# EasyEDA Pro project ProPrj_STM32音响_2025-06-08.epro, schematic TPA3116_替代方案
Board Name: TPA3116; Create Date: 2025-05-03; Page Name: TPA3116_TEST; Project Name: STM32多功能音响; Schematic Name: TPA3116_替代方案; Update Date: 2025-05-04; Company: 嘉立创EDA; Page Size: A4; Version: V1.0
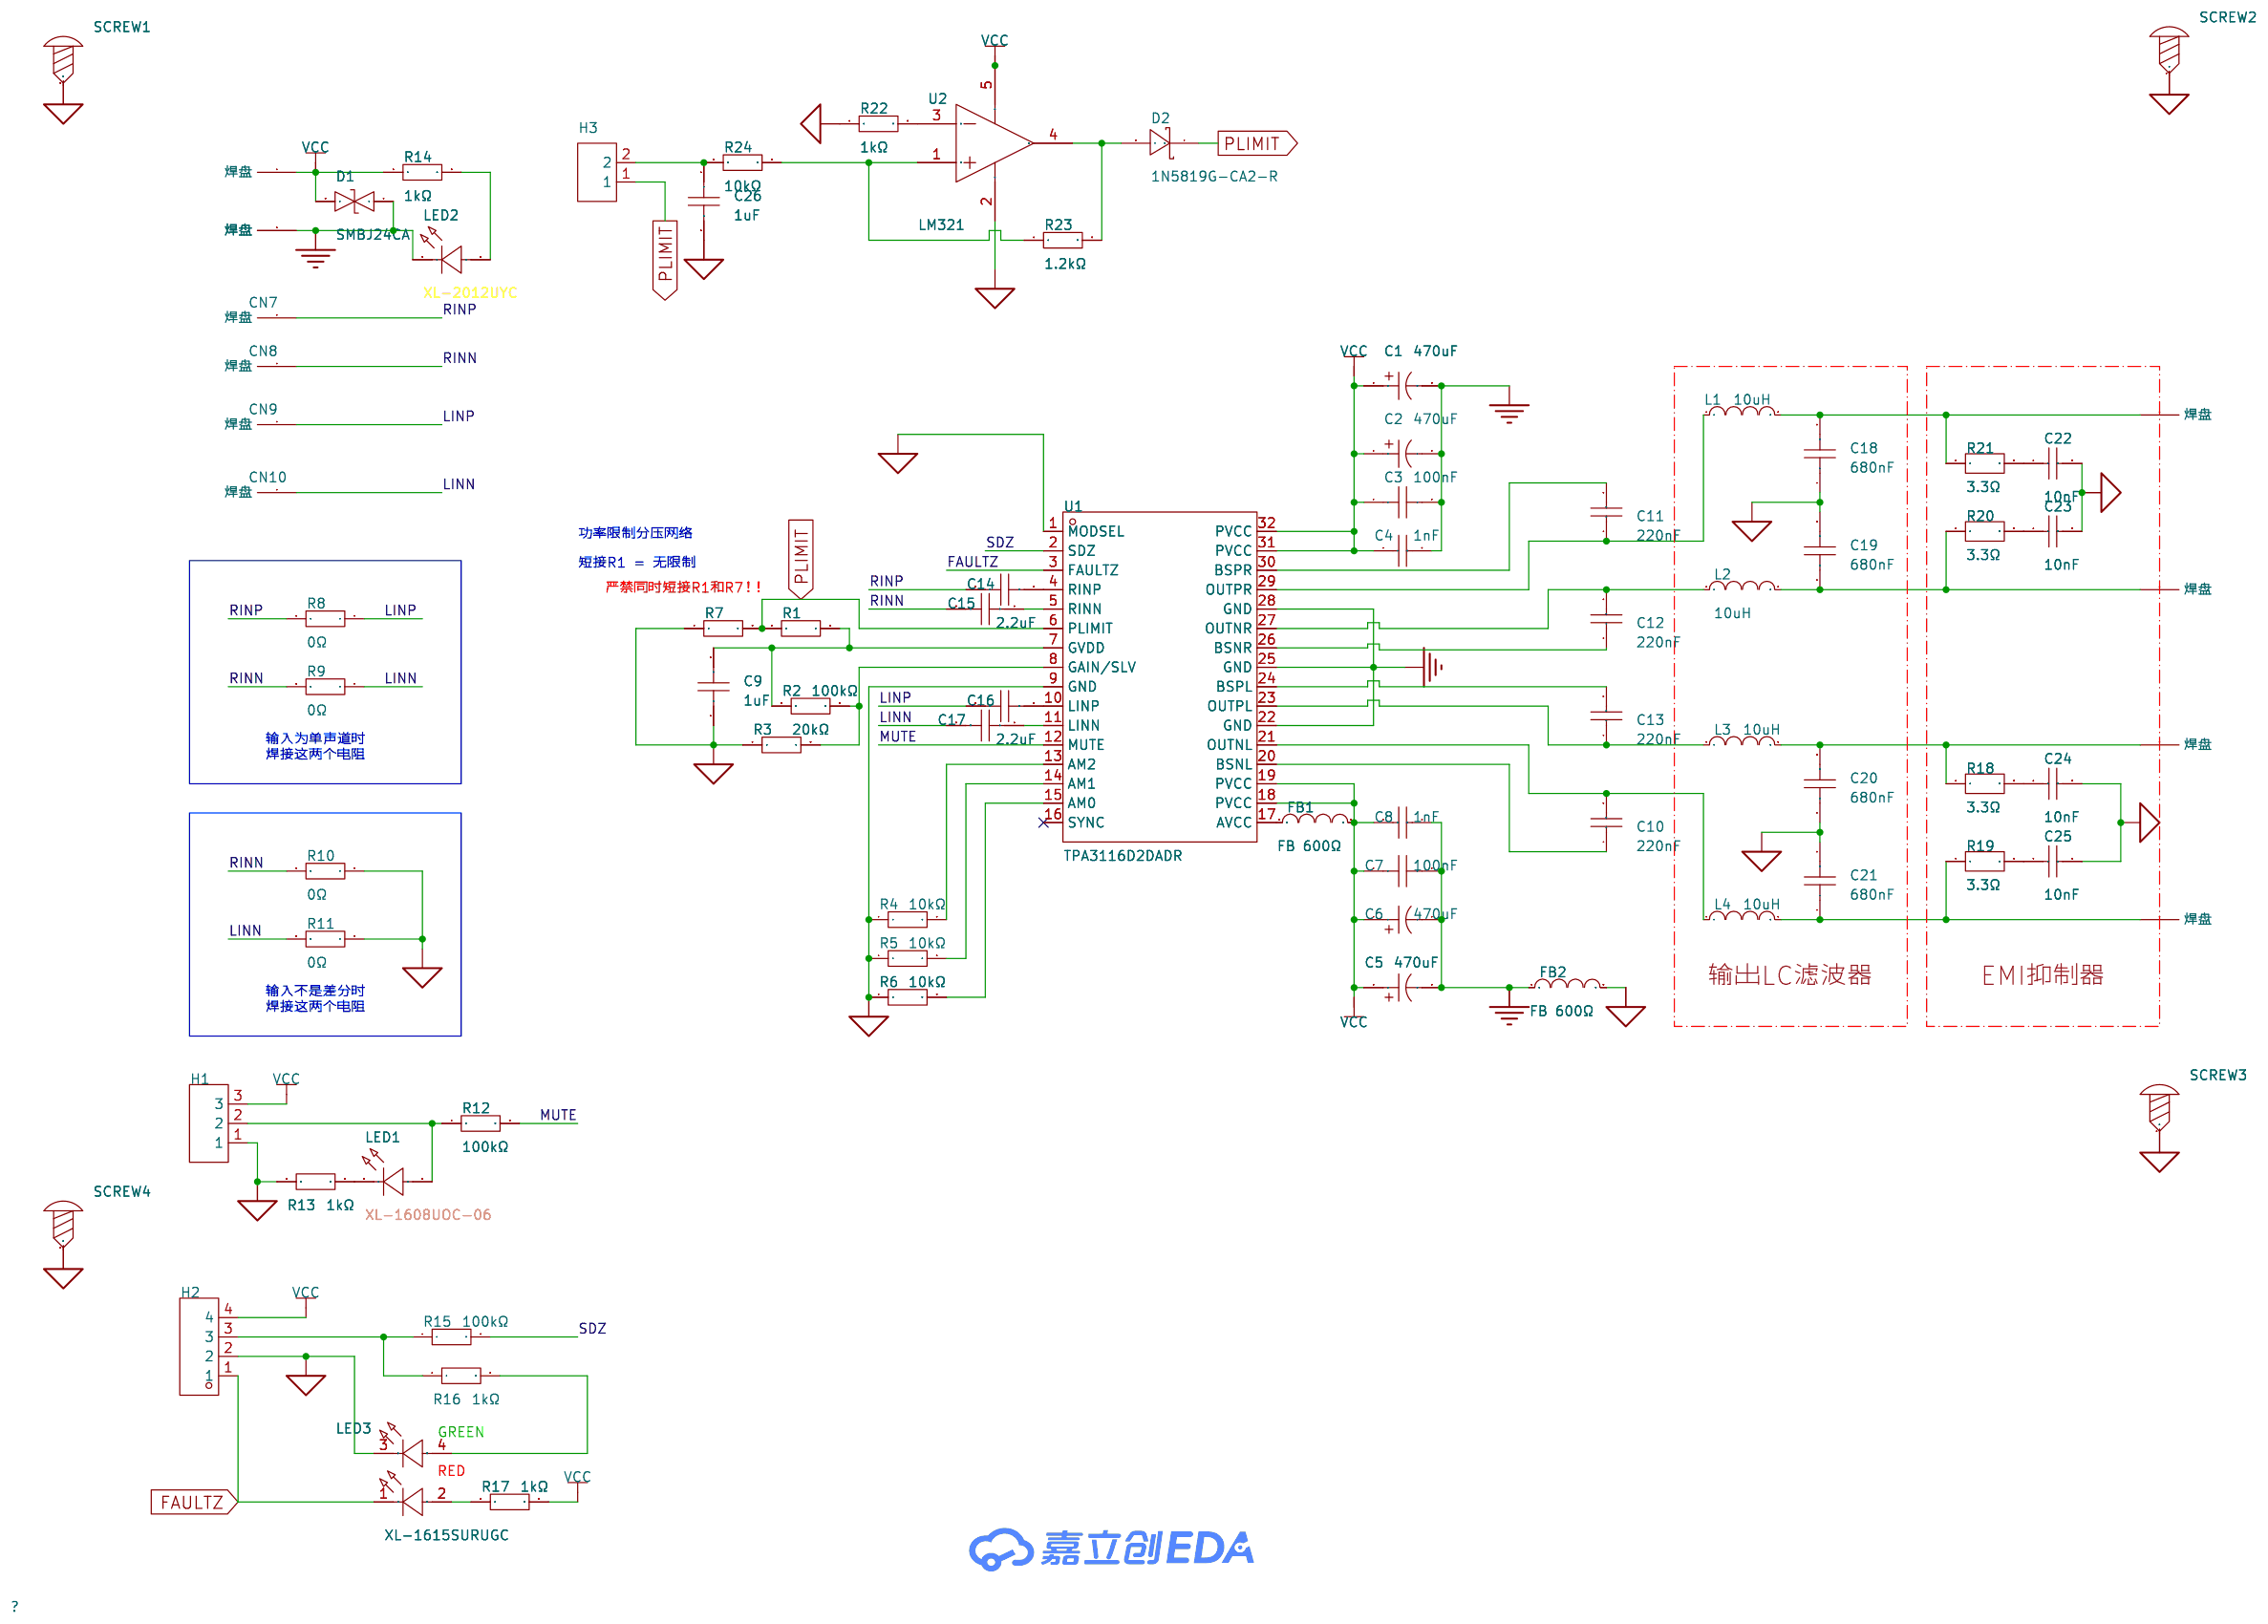
[diagram p12: schematic sheet]

## Parts
C1  470uF  [CAP-TH_BD10.0-P5.00-D0.6-FD-A]
C2  470uF  [CAP-TH_BD10.0-P5.00-D0.6-FD-A]
C3  100nF  [C0603]
C4  1nF  [C0603]
C5  470uF  [CAP-TH_BD10.0-P5.00-D0.6-FD-A]
C6  470uF  [CAP-TH_BD10.0-P5.00-D0.6-FD-A]
C7  100nF  [C0603]
C8  1nF  [C0603]
C9  1uF  [C0603]
C10  220nF  [C0603]
C11  220nF  [C0603]
C12  220nF  [C0603]
C13  220nF  [C0603]
C14  2.2uF  [C0805]
C15  2.2uF  [C0805]
C16  2.2uF  [C0805]
C17  2.2uF  [C0805]
C18  680nF  [C0603]
C19  680nF  [C0603]
C20  680nF  [C0603]
C21  680nF  [C0603]
C22  10nF  [C0603]
C23  10nF  [C0603]
C24  10nF  [C0603]
C25  10nF  [C0603]
C26  1uF  [C0603]
CN1  -  [穿孔圆焊盘 5-2.5mm]
CN2  -  [穿孔圆焊盘 5-2.5mm]
CN3  -  [穿孔圆焊盘 5-2.5mm]
CN4  -  [穿孔圆焊盘 5-2.5mm]
CN5  -  [穿孔圆焊盘 5-2.5mm]
CN6  -  [穿孔圆焊盘 5-2.5mm]
CN7  -  [长圆穿孔焊盘 4-2_1.5-0.75]
CN8  -  [长圆穿孔焊盘 4-2_1.5-0.75]
CN9  -  [长圆穿孔焊盘 4-2_1.5-0.75]
CN10  -  [长圆穿孔焊盘 4-2_1.5-0.75]
D1  SMBJ24CA  [SMB_L4.6-W3.6-LS5.3-BI]
D2  1N5819G-CA2-R  [SOD-123_L2.7-W1.6-LS3.7-RD-3]
FB1  FB 600Ω  [L0603]
FB2  FB 600Ω  [L0603]
H1  PZ254V-11-03P  [HDR-TH_3P-P2.54-V-M]
H2  PZ254V-11-04P  [HDR-TH_4P-P2.54-V-M]
H3  PZ254V-11-02P  [HDR-TH_2P-P2.54-V-M]
L1  10uH  [IND-SMD_L7.3-W6.8]
L2  10uH  [IND-SMD_L7.3-W6.8]
L3  10uH  [IND-SMD_L7.3-W6.8]
L4  10uH  [IND-SMD_L7.3-W6.8]
LED1  XL-1608UOC-06  [LED0603-R-RD_ORANGE]
LED2  XL-2012UYC  [LED0805-RD_YELLOW]
LED3  XL-1615SURUGC  [LED-SMD_4P-L1.6-W1.5-TL-1]
R1  0Ω  [R0603]
R2  100kΩ  [R0603]
R3  20kΩ  [R0603]
R4  10kΩ  [R0603]
R5  10kΩ  [R0603]
R6  10kΩ  [R0603]
R7  0Ω  [R0603]
R8  0Ω  [R0603]
R9  0Ω  [R0603]
R10  0Ω  [R0603]
R11  0Ω  [R0603]
R12  100kΩ  [R0603]
R13  1kΩ  [R0603]
R14  1kΩ  [R0603]
R15  100kΩ  [R0603]
R16  1kΩ  [R0603]
R17  1kΩ  [R0603]
R18  3.3Ω  [R0603]
R19  3.3Ω  [R0603]
R20  3.3Ω  [R0603]
R21  3.3Ω  [R0603]
R22  1kΩ  [R0603]
R23  1.2kΩ  [R0603]
R24  10kΩ  [R0603]
SCREW1  -  [M2螺丝]
SCREW2  -  [M2螺丝]
SCREW3  -  [M2螺丝]
SCREW4  -  [M2螺丝]
U1  TPA3116D2DADR  [HTSSOP-32_L11.0-W6.1-P0.65-LS8.1-BL-EP-2]
U2  LM321  [SOT-23-5_L3.0-W1.7-P0.95-LS2.8-BR]

## Library data of the parts
C1 C2 C5 C6 = HG1V477M1012PC: 容值:470uF;精度:±20%;额定电压:35V;; LCSC Part Name: 470uF ±20% 35V; Supplier Part: C2895788; Manufacturer: HONOR(荣誉); Supplier Footprint: 插件,D10xL12.5mm; JLCPCB Part Class: 扩展库; Datasheet: https://atta.szlcsc.com/upload/public/pdf/source/20210929/8011A4F59FC7A0F4147615E6D68E95E1.pdf; Supplier: LCSC; Tolerance: ±20%; Voltage Rating: 35V; Diameter: 10mm; Height - Seated (Max): 12.5mm; Lifetime: 2000hrs@105℃; Operating Temperature: -55℃~+105℃
C3 C7 = CGA0603X7R104K500JT: 容值:100nF;精度:±10%;额定电压:50V;材质(温度系数):X7R;; LCSC Part Name: 100nF ±10% 50V; Supplier Part: C6119867; Manufacturer: HRE(芯声); Supplier Footprint: 0603; JLCPCB Part Class: Extended Part; Supplier: LCSC; Tolerance: ±10%; Voltage Rated: 50V; Temperature Coefficient: X7R
C4 C8 = CC0603KRX7R9BB102: 容值:1nF;精度:±10%;额定电压:50V;材质(温度系数):X7R;; LCSC Part Name: 1nF ±10% 50V; Supplier Part: C100040; Manufacturer: YAGEO(国巨); Supplier Footprint: 0603; JLCPCB Part Class: Extended Part; Datasheet: https://atta.szlcsc.com/upload/public/pdf/source/20180910/C282072_33301C7F631E79921B82A8DAC6BCC5B3.pdf; Supplier: LCSC; Tolerance: ±10%; Voltage Rated: 50V; Temperature Coefficient: X7R
C9 C26 = CGA0603X5R105K500JT: 容值:1uF;精度:±10%;额定电压:50V;材质(温度系数):X5R;; LCSC Part Name: 1uF ±10% 50V; Supplier Part: C6119852; Manufacturer: HRE(芯声); Supplier Footprint: 0603; JLCPCB Part Class: Extended Part; Supplier: LCSC; Tolerance: ±10%; Voltage Rated: 50V; Temperature Coefficient: X5R
C10-C13 = CL10B224KB8NNNC: 容值:220nF;精度:±10%;额定电压:50V;材质(温度系数):X7R;; LCSC Part Name: 220nF ±10% 50V; Supplier Part: C64705; Manufacturer: SAMSUNG(三星); Supplier Footprint: 0603; JLCPCB Part Class: 扩展库; Datasheet: https://atta.szlcsc.com/upload/public/pdf/source/20160218/1457707763339.pdf; Supplier: LCSC; Tolerance: ±10%; Voltage Rated: 50V; Temperature Coefficient: X7R
C14-C17 = CL21A225KBQNNNE: 容值:2.2uF;精度:±10%;额定电压:50V;材质(温度系数):X5R;; LCSC Part Name: 2.2uF ±10% 50V; Supplier Part: C377773; Manufacturer: SAMSUNG(三星); Supplier Footprint: 0805; JLCPCB Part Class: Basic Part; Datasheet: https://atta.szlcsc.com/upload/public/pdf/source/20160218/1457707763339.pdf; Supplier: LCSC; Tolerance: ±10%; Voltage Rated: 50V; Temperature Coefficient: X5R
C18-C21 = TCC0603X7R684K500CT: 容值:680nF;精度:±10%;额定电压:50V;温度系数:X7R;; LCSC Part Name: 680nF ±10% 50V; Supplier Part: C5360852; Manufacturer: CCTC(三环); Supplier Footprint: 0603; JLCPCB Part Class: 扩展库; Datasheet: https://atta.szlcsc.com/upload/public/pdf/source/20191203/C466239_F62A586702D44EEA1C39B32FC8662B21.pdf; Supplier: LCSC; Tolerance: ±10%; Voltage Rating: 50V; Temperature Coefficient: X7R
C22-C25 = CC0603KRX7R9BB103: 容值:10nF;精度:±10%;额定电压:50V;材质(温度系数):X7R;; LCSC Part Name: 10nF ±10% 50V; Supplier Part: C100042; Manufacturer: YAGEO(国巨); Supplier Footprint: 0603; JLCPCB Part Class: 扩展库; Datasheet: https://atta.szlcsc.com/upload/public/pdf/source/20181008/C309510_22F155564471FAF6A489F7D68F34234E.pdf; Supplier: LCSC; Tolerance: ±10%; Voltage Rated: 50V; Temperature Coefficient: X7R
CN1-CN6 = 焊盘: 圆形多层穿孔大焊盘
CN7-CN10 = 长圆穿孔焊盘 4-2_1.5-0.75
D1 = SMBJ24CA_C83268: 反向截止电压(Vrwm):24V;最大钳位电压:38.9V;峰值脉冲电流(Ipp)@10/1000us:15.5A;峰值脉冲功率(Ppp)@10/1000us:600W;击穿电压:26.7V;; Supplier Part: C83268; Manufacturer: Littelfuse(美国力特); Supplier Footprint: SMB(DO-214AA); JLCPCB Part Class: 扩展库; Datasheet: https://atta.szlcsc.com/upload/public/pdf/source/20190807/C409416_D98C874D944FBE9BE31A2BD6B7A21533.pdf; Supplier: LCSC; Reverse Stand-Off Voltage (Vrwm): 24V; Maximum Clamping Voltage: 38.9V; Peak Pulse Current (Ipp)@10/1000us: 15.5A; Peak Pulse Power Dissipation (Ppp)@10/1000us: 600W; Breakdown Voltage: 26.7V; Type: TVS
D2 = 1N5819G-CA2-R: 正向压降(Vf):600mV@1A;直流反向耐压(Vr):40V;整流电流:1A;; LCSC Part Name: 电压:40V 电流:1A; Supplier Part: C89634; Manufacturer: UTC(友顺); Supplier Footprint: SOD-123; JLCPCB Part Class: 扩展库; Datasheet: https://atta.szlcsc.com/upload/public/pdf/source/20170908/C89634_1504870152252958122.pdf; Supplier: LCSC; Forward Voltage (Vf@If): 600mV@1A; Reverse Voltage (Vr): 40V; Rectified Current: 1A
FB1 FB2 = BLM18AG601SN1D: 标称阻抗@测试频率:600Ω@100MHz;误差:±25%;直流电阻(RDC):380mΩ;; LCSC Part Name: 单路 0603磁珠 阻抗600Ω@100MHz; Supplier Part: C19330; Manufacturer: muRata(村田); Supplier Footprint: 0603; JLCPCB Part Class: 扩展库; Datasheet: https://atta.szlcsc.com/upload/public/pdf/source/20180329/C160981_FD3C2D2622A377E203B89F4AA32B0741.pdf; Supplier: LCSC; Impedance @ Frequency: 600Ω@100MHz; Tolerance: ±25%; DC Resistance: 380mΩ; Current Rating: 500mA; Circuits: 1
H1 = PZ254V-11-03P: 插针结构:1x3P;间距:2.54mm;行距:-;圆针/方针:方针;安装方式:直插;排数:单排;总PIN位数:3P;额定电流:3A;额定电压:250V;配合针长度:6mm;塑高:2.5mm;端接针长度:3mm;工作温度:-40℃~+105℃;颜色:黑色;; LCSC Part Name: 1x3P 间距:2.54mm 方针 直插; Supplier Part: C2937625; Manufacturer: XFCN(兴飞); Supplier Footprint: 插件,P=2.54mm; JLCPCB Part Class: Extended Part; Datasheet: https://atta.szlcsc.com/upload/public/pdf/source/20200309/C492402_8335C3D49C4E4C618838D59BB1D024C1.pdf; Supplier: LCSC; Pin Structure: 1x3P; Pitch: 2.54mm; Circluar Pins/Square Pins: 方针; Mounting Type: 直插; Number of Rows: 单排; Number of Pins: 3P; Current Rating: 3A; Voltage Rating (Max): 250V; Length of Mating Pin: 6mm; Insulation Height: 2.5mm; Length of End Connection Pin: 3mm; Operating Temperature: -40℃~+105℃; Color: 黑色
H2 = PZ254V-11-04P: 插针结构:1x4P;间距:2.54mm;行距:-;圆针/方针:方针;安装类型:直插;排数:单排;总PIN位数:4P;额定电流:3A;额定电压:250V;配合针长度:6mm;塑高:2.5mm;端接针长度:3mm;触头材质:-;工作温度范围:-40℃~+105℃;颜色:黑色;; LCSC Part Name: 间距:2.54mm 1x4P 直插 方针; Supplier Part: C2691448; Manufacturer: XFCN(兴飞); Supplier Footprint: 插件,P=2.54mm; JLCPCB Part Class: Extended Part; Datasheet: https://atta.szlcsc.com/upload/public/pdf/source/20200309/C492403_F9F19131791D08044AD4F84F8E751A34.pdf; Supplier: LCSC; Pin Structure: 1x4P; Pitch: 2.54mm; Circluar Pins/Square Pins: 方针; Mounting Type: 直插; Number of Rows: 单排; Number of Pins: 4P; Current Rating (Max): 3A; Voltage Rating (Max): 250V; Length of Mating Pin: 6mm; Insulation Height: 2.5mm; Length of End Connection Pin: 3mm; Operating Temperature Range: -40℃~+105℃; Color: 黑色
H3 = PZ254V-11-02P: 插针结构:1x2P;间距:2.54mm;行距:-;圆针/方针:方针;安装方式:直插;排数:单排;总PIN位数:2P;额定电流:-;额定电压:-;配合针长度:6mm;塑高:2.5mm;端接针长度:3mm;触头材质:黄铜;触头镀层:-;工作温度:-40℃~+105℃;颜色:黑色;; LCSC Part Name: 1x2P 间距:2.54mm 方针 直插; Supplier Part: C492401; Manufacturer: XFCN(兴飞); Supplier Footprint: 插件,P=2.54mm; JLCPCB Part Class: 扩展库; Datasheet: https://atta.szlcsc.com/upload/public/pdf/source/20200309/C492401_A812433581A9B211A7FFA413ADDFF0E5.pdf; Supplier: LCSC; Pin Structure: 1x2P; Pitch: 2.54mm; Circluar Pins/Square Pins: 方针; Mounting Type: 直插; Number of Rows: 单排; Number of Pins: 2P; Length of Mating Pin: 6mm; Insulation Height: 2.5mm; Length of End Connection Pin: 3mm; Contact Material: 黄铜; Operating Temperature: -40℃~+105℃; Color: 黑色
L1-L4 = FXL0630-100-M: 电感值:10uH;精度:±20%;额定电流:4.5A;饱和电流(Isat):5.5A;类型:一体成型电感;; LCSC Part Name: 10uH ±20% 5.5A; Supplier Part: C167223; Manufacturer: cjiang(长江微电); Supplier Footprint: SMD,6.6x7mm; JLCPCB Part Class: 扩展库; Datasheet: https://atta.szlcsc.com/upload/public/pdf/source/20240426/3189EA8206330E2108542F9E34E540E7.pdf; Supplier: LCSC; Tolerance: ±20%; Rated Current: 4.5A; Saturation Current (Isat): 5.5A; DC Resistance (DCR): 68mΩ; Type: 一体成型电感
LED1 = XL-1608UOC-06: 发光颜色:橙色;正向压降(Vf):2.3V;功率:50mW;正向电流:20mA;波长:600nm~610nm;透镜颜色:无色透明透镜;色温:-;发光强度:315mcd;发光角度:120°;载带方式:正贴;工作温度:-20℃~+85℃;; Supplier Part: C965800; Manufacturer: XINGLIGHT(成兴光); Supplier Footprint: 0603; JLCPCB Part Class: 扩展库; Datasheet: https://atta.szlcsc.com/upload/public/pdf/source/20250225/A49E74DEE4EB46C66A8B6E8A8B81C88C.pdf; Supplier: LCSC; Illumination Color: 橙色; Voltage - Forward(Vf): 2.3V; Power(Watts): 50mW; Forward Current: 20mA; Wavelength - Dominant: 600nm~610nm; Peak Wavelength: 605nm; Lens Color: 无色透明透镜; Luminous Intensity: 315mcd; Viewing Angle: 120°; Mounting Sytle: 正贴; Operating Temperature: -20℃~+85℃
LED2 = XL-2012UYC: 发光颜色:黄色;功率:55mW;正向电流:25mA;主波长:589nm~591nm;透镜颜色:无色透明透镜;色温:-;发光角度:120°;载带方式:正贴;工作温度:-30℃~+85℃;; Supplier Part: C965814; Manufacturer: XINGLIGHT(成兴光); Supplier Footprint: 0805; JLCPCB Part Class: 扩展库; Datasheet: https://atta.szlcsc.com/upload/public/pdf/source/20240218/F4CDC90F388215F4F589FFD2BE20C678.pdf; Supplier: LCSC; Emitted Color: 黄色; Power Dissipation: 55mW; Forward Current: 25mA; Dominant Wavelength: 589nm~591nm; Peak Wavelength: 593nm; Lens Color: 无色透明透镜; Viewing Angle: 120°; Mounting Sytle: 正贴; Operating Temperature: -30℃~+85℃
LED3 = XL-1615SURUGC: 灯头类型:-;发光颜色:红色,翠绿色;正向电压(VF):2.4V；3.4V;功率:50mW；70mW;正向电流:20mA;主波长:620nm~630nm；520nm~530nm;二极管配置:共阳极;透镜颜色:无色透明透镜;色温:-;发光强度:180mcd；1200mcd;发光角度:120°;载带方式:正贴;工作温度:-20℃~+85℃;; Supplier Part: C965839; Manufacturer: XINGLIGHT(成兴光); Supplier Footprint: 0606; JLCPCB Part Class: 扩展库; Datasheet: https://atta.szlcsc.com/upload/public/pdf/source/20240218/35712C22C656BF32DD47CE2B5103C1D3.pdf; Supplier: LCSC; Emitted Color: 红色,翠绿色; Forward Voltage (VF): 2.4V；3.4V; Power Dissipation: 50mW；70mW; Forward Current: 20mA; Dominant Wavelength: 620nm~630nm；520nm~530nm; Peak Wavelength: 525nm；625nm; Diode Configuration: 共阳极; Lens Color: 无色透明透镜; Luminous Intensity: 180mcd；1200mcd; Viewing Angle: 120°; Mounting Sytle: 正贴; Operating Temperature: -20℃~+85℃
R1 R7 = 0603WAF0000T5E: 电阻类型:厚膜电阻;阻值:0Ω;精度:±1%;功率:100mW;最大工作电压:75V;; LCSC Part Name: 0Ω ±1% 100mW 厚膜电阻; Supplier Part: C21189; Manufacturer: UNI-ROYAL(厚声); Supplier Footprint: 0603; JLCPCB Part Class: 基础库; Datasheet: https://atta.szlcsc.com/upload/public/pdf/source/20200306/C422600_1E6D84923E4A46A82E41ADD87F860B5C.pdf; Supplier: LCSC; Type: 厚膜电阻; Tolerance: ±1%; Power(Watts): 100mW; Overload Voltage (Max): 75V; Operating Temperature Range: -55℃~+155℃
R2 R12 R15 = 0603WAF1003T5E: 电阻类型:厚膜电阻;阻值:100kΩ;精度:±1%;功率:100mW;最大工作电压:75V;温度系数:±100ppm/℃;; LCSC Part Name: 100kΩ ±1% 100mW 厚膜电阻; Supplier Part: C25803; Manufacturer: UNI-ROYAL(厚声); Supplier Footprint: 0603; JLCPCB Part Class: Basic Part; Datasheet: https://atta.szlcsc.com/upload/public/pdf/source/20200306/C422600_1E6D84923E4A46A82E41ADD87F860B5C.pdf; Supplier: LCSC; Type: 厚膜电阻; Tolerance: ±1%; Power(Watts): 100mW; Overload Voltage (Max): 75V; Temperature Coefficient: ±100ppm/℃; Operating Temperature Range: -55℃~+155℃
R3 = 0603WAF2002T5E: 电阻类型:厚膜电阻;阻值:20kΩ;精度:±1%;功率:100mW;最大工作电压:75V;温度系数:±100ppm/℃;; LCSC Part Name: 20kΩ ±1% 100mW 厚膜电阻; Supplier Part: C4184; Manufacturer: UNI-ROYAL(厚声); Supplier Footprint: 0603; JLCPCB Part Class: 基础库; Datasheet: https://atta.szlcsc.com/upload/public/pdf/source/20200306/C422600_1E6D84923E4A46A82E41ADD87F860B5C.pdf; Supplier: LCSC; Type: 厚膜电阻; Tolerance: ±1%; Power(Watts): 100mW; Overload Voltage (Max): 75V; Temperature Coefficient: ±100ppm/℃; Operating Temperature Range: -55℃~+155℃
R4-R6 R24 = 0603WAF1002T5E: 电阻类型:厚膜电阻;阻值:10kΩ;精度:±1%;功率:100mW;最大工作电压:75V;温度系数:±100ppm/℃;; LCSC Part Name: 厚膜电阻 10kΩ ±1% 100mW; Supplier Part: C25804; Manufacturer: UNI-ROYAL(厚声); Supplier Footprint: 0603; JLCPCB Part Class: 基础库; Datasheet: https://atta.szlcsc.com/upload/public/pdf/source/20200306/C422600_1E6D84923E4A46A82E41ADD87F860B5C.pdf; Supplier: LCSC; Type: 厚膜电阻; Tolerance: ±1%; Power(Watts): 100mW; Overload Voltage (Max): 75V; Temperature Coefficient: ±100ppm/℃; Operating Temperature Range: -55℃~+155℃
R8-R11 = 0603WAF0000T5E: 电阻类型:厚膜电阻;阻值:0Ω;精度:±1%;功率:100mW;最大工作电压:75V;; LCSC Part Name: 0Ω ±1% 100mW 厚膜电阻; Supplier Part: C21189; Manufacturer: UNI-ROYAL(厚声); Supplier Footprint: 0603; JLCPCB Part Class: Basic Part; Datasheet: https://atta.szlcsc.com/upload/public/pdf/source/20200306/C422600_1E6D84923E4A46A82E41ADD87F860B5C.pdf; Supplier: LCSC; Type: 厚膜电阻; Tolerance: ±1%; Power(Watts): 100mW; Overload Voltage (Max): 75V; Operating Temperature Range: -55℃~+155℃
R13 R14 R16 R17 R22 = 0603WAF1001T5E: 电阻类型:厚膜电阻;阻值:1kΩ;精度:±1%;功率:100mW;最大工作电压:75V;温度系数:±100ppm/℃;; LCSC Part Name: 1kΩ ±1% 100mW 厚膜电阻; Supplier Part: C21190; Manufacturer: UNI-ROYAL(厚声); Supplier Footprint: 0603; JLCPCB Part Class: Basic Part; Datasheet: https://atta.szlcsc.com/upload/public/pdf/source/20200306/C422600_1E6D84923E4A46A82E41ADD87F860B5C.pdf; Supplier: LCSC; Type: 厚膜电阻; Tolerance: ±1%; Power(Watts): 100mW; Overload Voltage (Max): 75V; Temperature Coefficient: ±100ppm/℃; Operating Temperature Range: -55℃~+155℃
R18-R21 = FRC0603F3R30TS: 电阻类型:厚膜电阻;阻值:3.3Ω;精度:±1%;功率:100mW;最大工作电压:75V;温度系数:±200ppm/℃;; LCSC Part Name: 3.3Ω ±1% 100mW 厚膜电阻; Supplier Part: C2930016; Manufacturer: FOJAN(富捷); Supplier Footprint: 0603; JLCPCB Part Class: 扩展库; Datasheet: https://atta.szlcsc.com/upload/public/pdf/source/20211221/925EC7D7225764EE0046F22065062C87.pdf; Supplier: LCSC; Type: 厚膜电阻; Tolerance: ±1%; Power(Watts): 100mW; Overload Voltage (Max): 75V; Temperature Coefficient: ±200ppm/℃; Operating Temperature Range: -55℃~+155℃
R23 = FRC0603F1201TS: 电阻类型:厚膜电阻;阻值:1.2kΩ;精度:±1%;功率:100mW;最大工作电压:75V;温度系数:±100ppm/℃;; LCSC Part Name: 1.2kΩ ±1% 100mW 厚膜电阻; Supplier Part: C2906976; Manufacturer: FOJAN(富捷); Supplier Footprint: 0603; JLCPCB Part Class: Extended Part; Datasheet: https://atta.szlcsc.com/upload/public/pdf/source/20211221/925EC7D7225764EE0046F22065062C87.pdf; Supplier: LCSC; Type: 厚膜电阻; Tolerance: ±1%; Power(Watts): 100mW; Overload Voltage (Max): 75V; Temperature Coefficient: ±100ppm/℃; Operating Temperature Range: -55℃~+155℃
SCREW1-SCREW4 = M2螺丝: Supplier Footprint: 插件
U1 = TPA3116D2DADR: 功放类型:D类功放;扬声器通道数:双声道;输出功率:50Wx2@4Ω;; LCSC Part Name: 15W, 30W, 50W 无滤波器 Class-D 立体声功率放大器; Supplier Part: C50144; Manufacturer: TI(德州仪器); Supplier Footprint: HTSSOP-32-6.1mm; JLCPCB Part Class: 扩展库; Datasheet: https://www.ti.com/cn/lit/gpn/tpa3116d2; Supplier: LCSC; Type of Power Amplifier: D类功放; Speaker Channels: 双声道; Output Power: 50Wx2@4Ω; Supply Voltage: 4.5V~26V
U2 = LM321_C5252901: 放大器数:单路;轨到轨:-;增益带宽积(GBP):1.2MHz;输入失调电压(Vos):5mV;压摆率(SR):-;输入偏置电流(Ib):50nA;; LCSC Part Name: 增益带宽(GBP)1.2MHZ VIO:5mV LM321 丝印A63A 丝印A63A; Supplier Part: C5252901; Manufacturer: MSKSEMI(美森科); Supplier Footprint: SOT-23-5; JLCPCB Part Class: 扩展库; Datasheet: https://atta.szlcsc.com/upload/public/pdf/source/20240508/77565F0A1749F49B56A2EABE562B96C4.pdf; Supplier: LCSC; Number of Circuits: 单路; Maximum Power Supply Range (Vdd-Vss): 36V; Gain Bandwidth Product(GBP): 1.2MHz; Voltage - Input Offset(Vos): 5mV; Current - Input Bias(Ib): 50nA; Common Mode Rejection Ratio (CMRR): 80dB; Operating Temperature: 0℃~+70℃

## Nets
AGND: C9.1 C18.1 C19.2 C20.1 C21.2 C22.2 C23.2 C24.2 C25.2 C26.2 FB2.2 H1.1 H2.2 LED3.3(G-) R3.1 R4.1 R5.1 R6.1 R7.1 R10.1 R11.1 R13.1 R22.1 SCREW1.1 SCREW2.1 SCREW3.1 SCREW4.1 U1.1(MODSEL) U1.9(GND) U2.2(V-)
PGND: C1.2 C2.2 C3.2 C4.2 C5.2 C6.2 C7.2 C8.2 CN6.1(焊盘) D1.1(K) FB2.1 LED2.1(K) U1.22(GND) U1.25(GND) U1.28(GND)
VCC: C1.1 C2.1 C3.1 C4.1 C5.1 C6.1 C7.1 C8.1 CN5.1(焊盘) D1.2(A) FB1.2 H1.3 H2.4 R14.1 R17.2 U1.18(PVCC) U1.19(PVCC) U1.31(PVCC) U1.32(PVCC) U2.5(V+)
FAULTZ: H2.1 LED3.1(R-) U1.3(FAULTZ)
LINN: C17.2 CN10.1(焊盘) R9.1 R11.2
LINP: C16.2 CN9.1(焊盘) R8.1
MUTE: R12.2 U1.12(MUTE)
PLIMIT: D2.1(C) H3.1 R1.1 R7.2 U1.6(PLIMIT)
RINN: C15.2 CN8.1(焊盘) R9.2 R10.2
RINP: C14.2 CN7.1(焊盘) R8.2
SDZ: R15.2 U1.2(SDZ)
$1N931: FB1.1 U1.17(AVCC)
$1N1192: C9.2 R1.2 R2.1 U1.7(GVDD)
$1N1197: R2.2 R3.2 U1.8(GAIN/SLV)
$1N1486: R4.2 U1.13(AM2)
$1N1491: R5.2 U1.14(AM1)
$1N1497: R6.2 U1.15(AM0)
$1N1764: C10.2 L4.1 U1.21(OUTNL)
$1N1768: C10.1 U1.20(BSNL)
$1N1917: C11.2 U1.30(BSPR)
$1N1948: C12.2 L2.1 U1.27(OUTNR)
$1N1956: C12.1 U1.26(BSNR)
$1N1964: C13.2 U1.24(BSPL)
$1N1970: C13.1 L3.1 U1.23(OUTPL)
$1N2035: C11.1 L1.1 U1.29(OUTPR)
$1N2180: C14.1 U1.4(RINP)
$1N2218: C15.1 U1.5(RINN)
$1N2383: C16.1 U1.10(LINP)
$1N2387: C17.1 U1.11(LINN)
$1N2892: C18.2 CN1.1(焊盘) L1.2 R21.1
$1N2900: C19.1 CN2.1(焊盘) L2.2 R20.1
$1N2902: C20.2 CN3.1(焊盘) L3.2 R18.1
$1N2906: C21.1 CN4.1(焊盘) L4.2 R19.1
$1N4731: H1.2 LED1.1(K) R12.1
$1N4980: LED1.2(A) R13.2
$1N5308: LED2.2(A) R14.2
$1N5465: H2.3 R15.1 R16.1
$1N5534: LED3.4(G+) R16.2
$1N5603: LED3.2(R+) R17.1
$1N5880: C22.1 R21.2
$1N5916: C23.1 R20.2
$1N5952: C24.1 R18.2
$1N5988: C25.1 R19.2
$1N8191: R22.2 U2.3(IN-)
$1N14597: C26.1 H3.2 R24.1
$1N14607: R23.1 R24.2 U2.1(IN+)
$1N18771: D2.2(A) R23.2 U2.4(OUT)

Not connected (* = marked no-connect by the designer): U1 16(SYNC)*

## Notes on the sheet
- 功率限制分压网络
- 短接R1 = 无限制
- 严禁同时短接R1和R7！！
- 输入为单声道时
  焊接这两个电阻
- 输出LC滤波器
- EMI抑制器
- 输入不是差分时
  焊接这两个电阻
- GREEN
- RED
